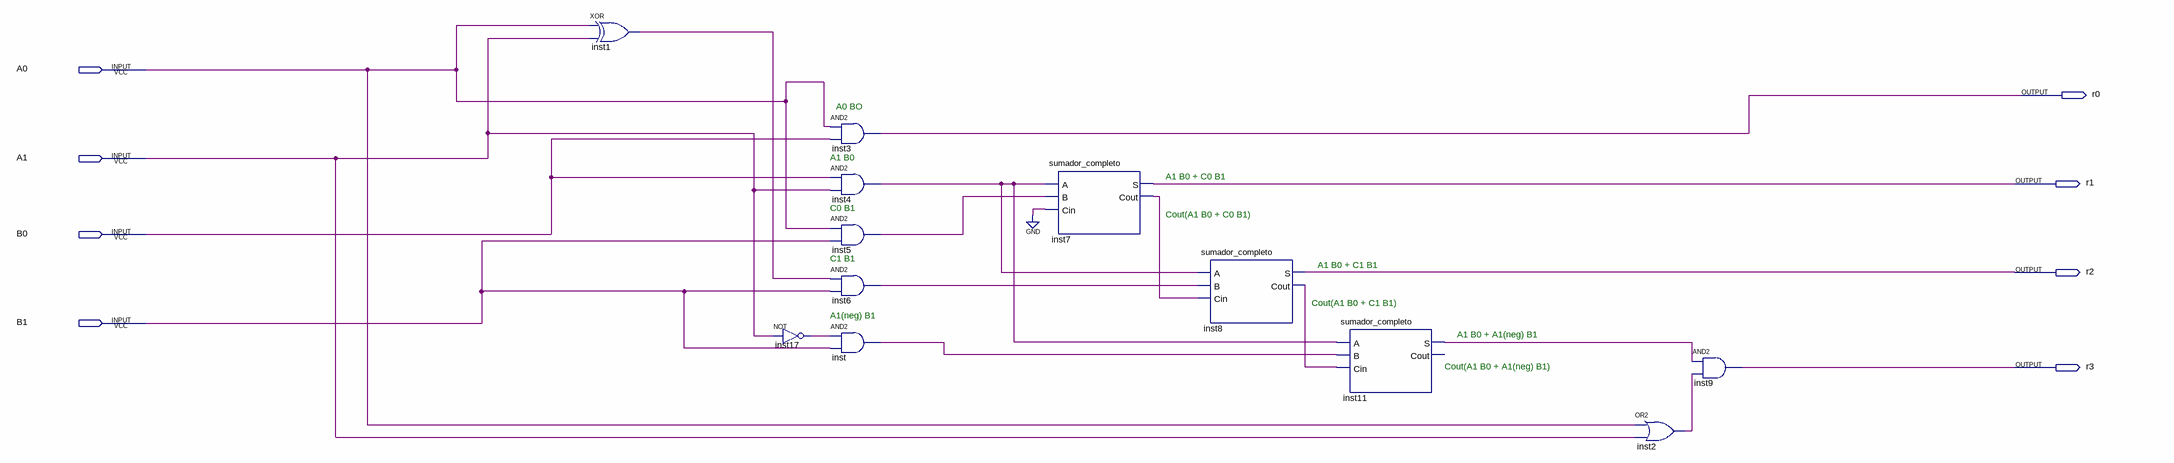
[diagram p0: schematic sheet]
// Quartus schematic multi_2b_csed.bdf as structural Verilog: 12 symbols, 8 pins
module multi_2b_csed (
  input  A0,
  input  A1,
  input  B0,
  input  B1,
  output r0,
  output r1,
  output r2,
  output r3
);

  wire inst1_out, inst2_out, inst4_out, inst5_out, inst6_out, inst7_cout, inst8_cout, inst11_s, inst17_out,
       inst_out;

  xor inst1 (inst1_out, A0, A1);
  not inst17 (inst17_out, A1);
  and inst3 (r0, A0, B0);
  and inst4 (inst4_out, B0, A1);
  and inst5 (inst5_out, A0, B1);
  and inst6 (inst6_out, inst1_out, B1);
  and inst (inst_out, inst17_out, B1);
  sumador_completo inst7 (.A(inst4_out), .B(inst5_out), .Cin(1'b0), .S(r1), .Cout(inst7_cout));
  sumador_completo inst8 (.A(inst4_out), .B(inst6_out), .Cin(inst7_cout), .S(r2), .Cout(inst8_cout));
  sumador_completo inst11 (.A(inst4_out), .B(inst_out), .Cin(inst8_cout), .S(inst11_s));  // open: Cout
  or inst2 (inst2_out, A0, A1);
  and inst9 (r3, inst11_s, inst2_out);

  // Notes on the sheet:
  //   A0 BO
  //   A1 B0
  //   A1 B0 + C0 B1
  //   C0 B1
  //   Cout(A1 B0 + C0 B1)
  //   C1 B1
  //   A1 B0 + C1 B1
  //   Cout(A1 B0 + C1 B1)
  //   A1(neg) B1
  //   A1 B0 + A1(neg) B1
  //   Cout(A1 B0 + A1(neg) B1)
endmodule
